# EAGLE design nixie_controller (EAGLE 9.5.2)

## Sheet 1 of 2
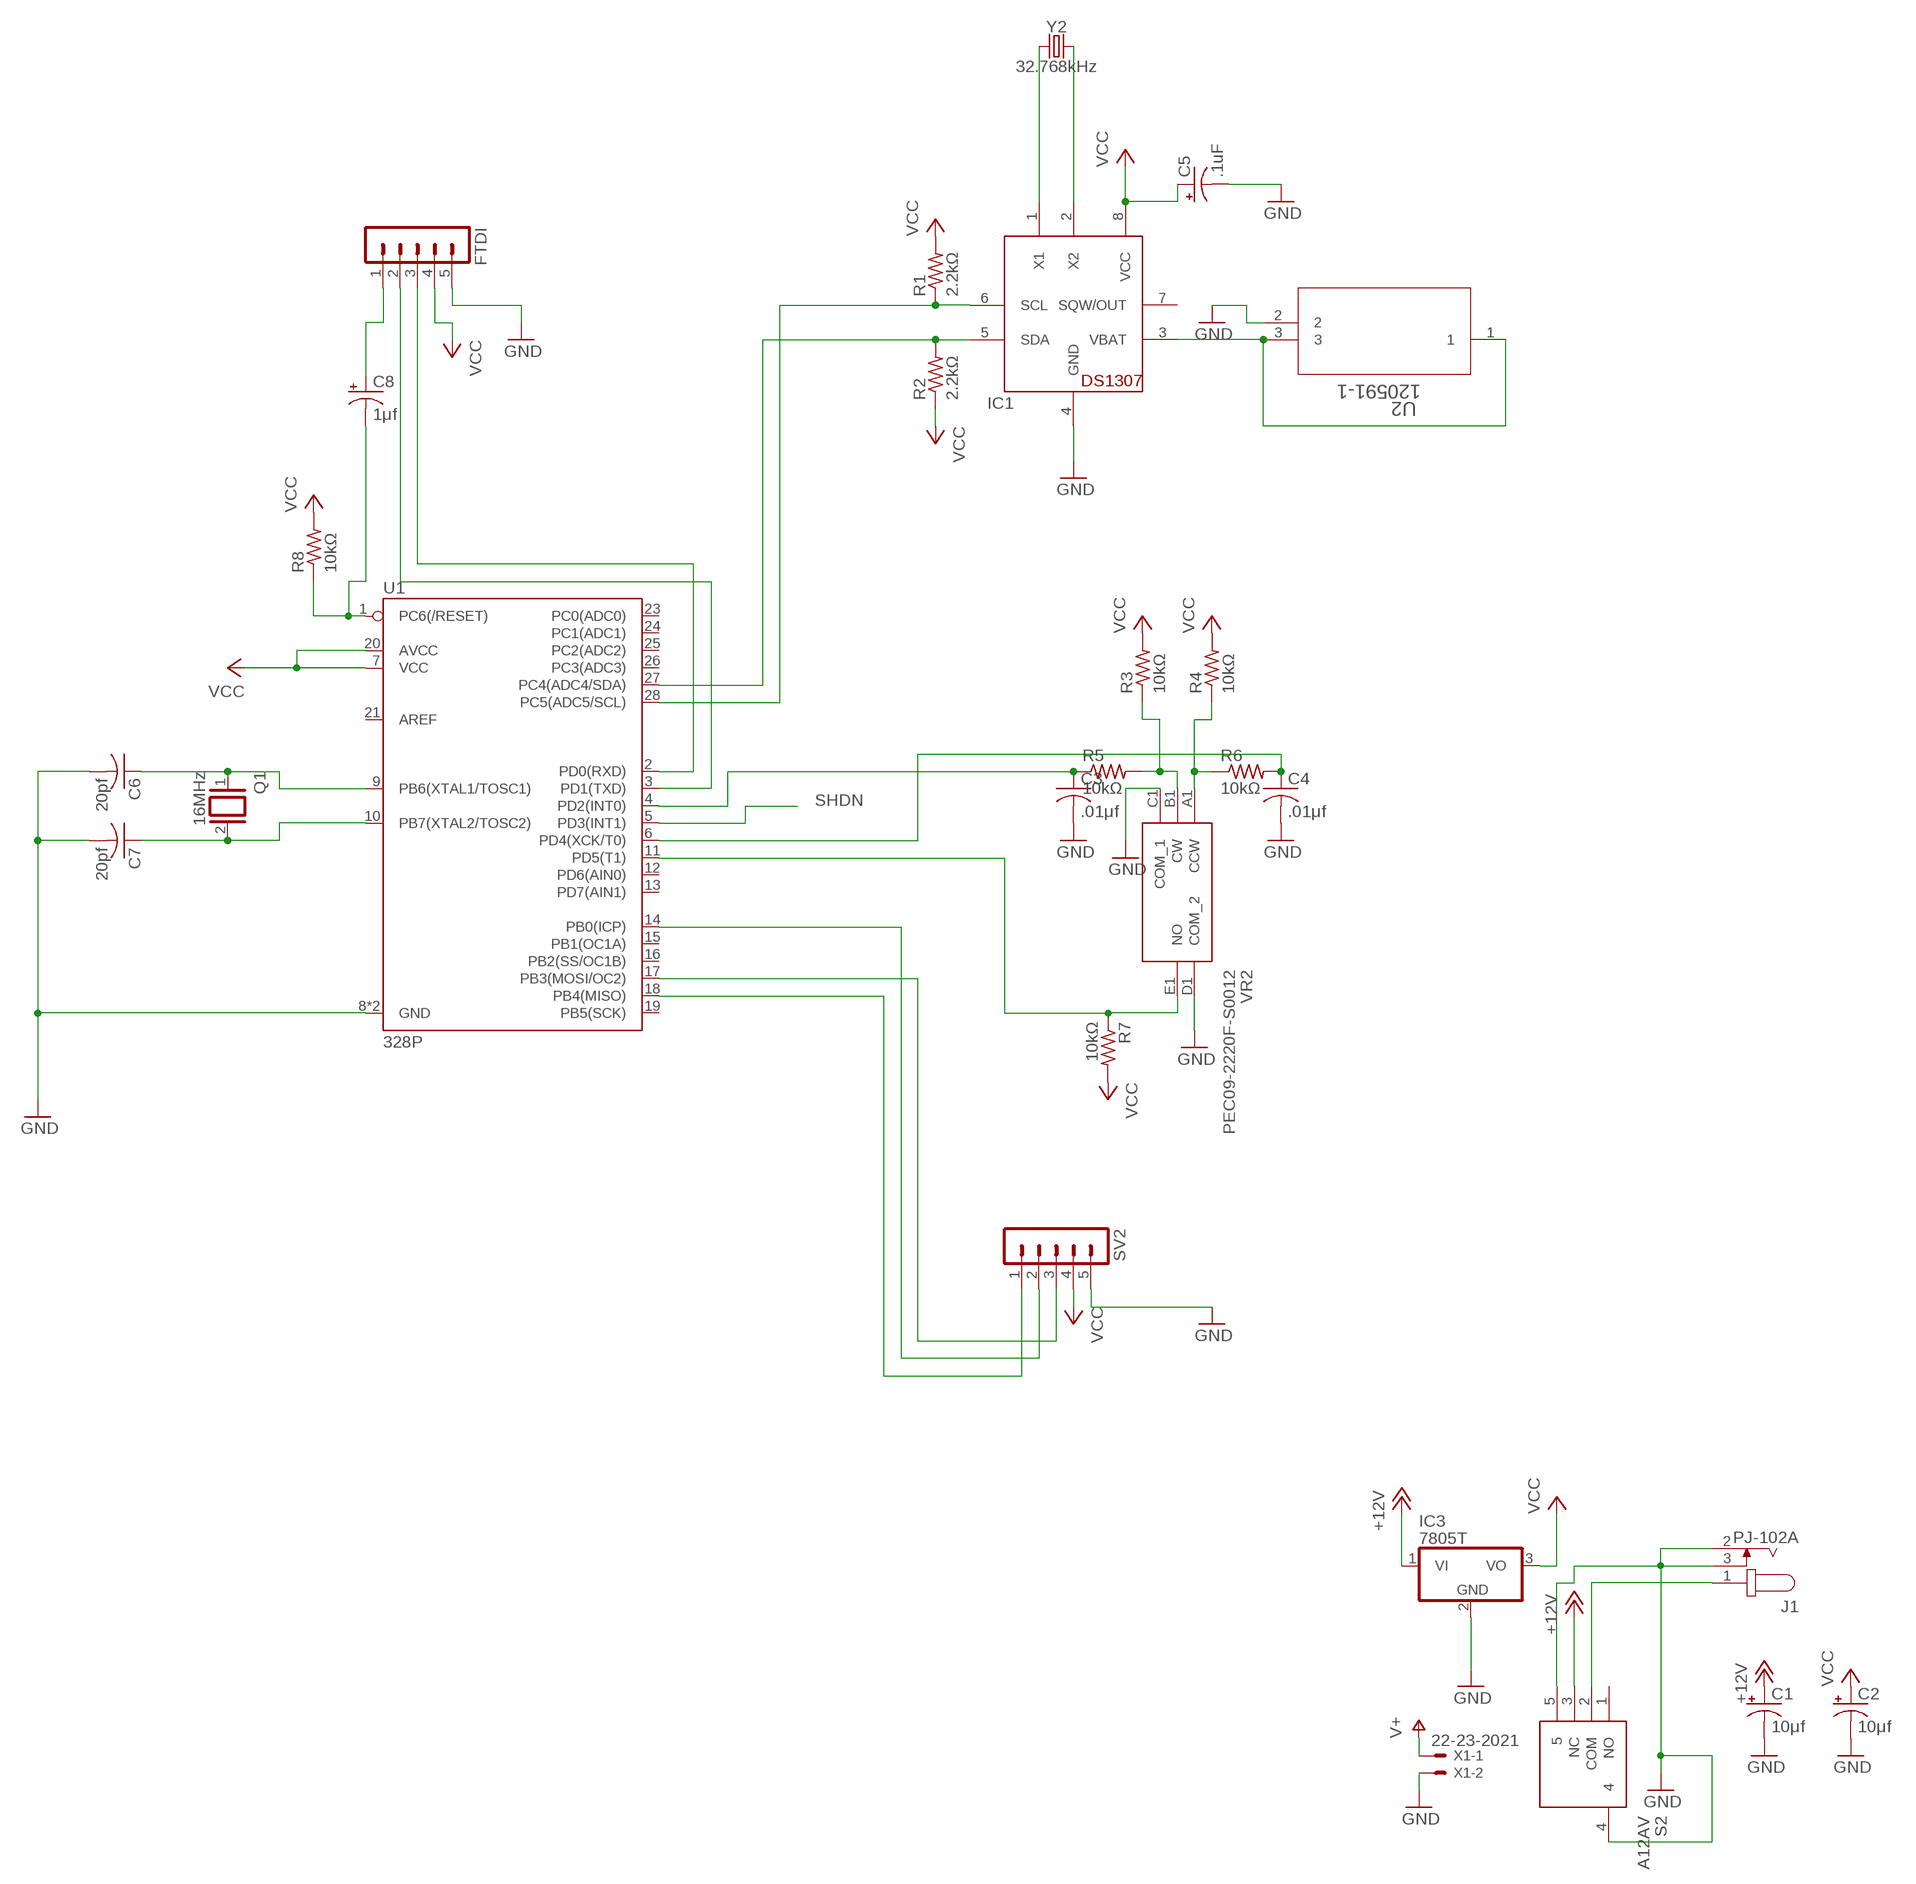
[diagram p0: schematic, sheet 1]

### Parts
C1  10μf  CPOL-USE2-5  [E2-5]
C2  10μf  CPOL-USE2-5  [E2-5]
C3  .01μf  C-US050-030X075  [C050-030X075]
C4  .01μf  C-US050-030X075  [C050-030X075]
C5  .1uF  CPOL-USE2-5  [E2-5]
C6  20pf  C-US050-030X075  [C050-030X075]
C7  20pf  C-US050-030X075  [C050-030X075]
C8  1μf  CPOL-USE2-5  [E2-5]
FTDI  MA05-1  [MA05-1]
IC1  DS1307  [DIL08]
IC3  7805T  [TO220H]
J1  PJ-102A  [CUI_PJ-102A]
Q1  16MHz  XTAL/S  [QS]
R1  2.2kΩ  R-US_0207/10  [0207/10]
R2  2.2kΩ  R-US_0207/10  [0207/10]
R3  10kΩ  R-US_0207/10  [0207/10]
R4  10kΩ  R-US_0207/10  [0207/10]
R5  10kΩ  R-US_0207/10  [0207/10]
R6  10kΩ  R-US_0207/10  [0207/10]
R7  10kΩ  R-US_0207/10  [0207/10]
R8  10kΩ  R-US_0207/10  [0207/10]
S2  A12AV  [A12AV]
SV2  MA05-1  [MA05-1]
U1  328P  ATMEGA328P_PDIP  [DIP28]
U2  120591-1  [CONN3_120591-1]
VR2  PEC09-2220F-S0012  [PEC092220FS0012]
X1  22-23-2021  [22-23-2021]
Y2  32.768kHz  CRYSTAL-32.768KHZPTH-2X6  [CRYSTAL-PTH-2X6-CYL]

### Nets
+12V: C1.+ IC3.1(VI) S2.3(NC) ; also sheet 2
CLK: SV2.1 U1.18(PB4(MISO))
GND [power]: C1.- C2.- C3.2 C4.2 C5.- C6.2 C7.2 FTDI.5 IC1.4(GND) IC3.2(GND) J1.2 J1.3 S2.4 S2.5 SV2.5 U1.8(GND) U1.22(GND) U2.2 VR2.C1(COM_1) VR2.D1(COM_2) X1.2 ; also sheet 2
N$1: IC1.3(VBAT) U2.1 U2.3
N$2: R7.1 U1.11(PD5(T1)) VR2.E1(NO)
N$3: R4.1 R6.1 VR2.A1(CCW)
N$4: IC1.1(X1) Y2.1
N$5: IC1.2(X2) Y2.2
N$6: J1.1 S2.2(COM)
N$7: SV2.2 U1.14(PB0(ICP))
N$9: C3.1 R5.1 U1.4(PD2(INT0))
N$10: C4.1 R6.2 U1.6(PD4(XCK/T0))
N$11: C6.1 Q1.1 U1.9(PB6(XTAL1/TOSC1))
N$12: IC1.6(SCL) R1.1 U1.28(PC5(ADC5/SCL))
N$13: IC1.5(SDA) R2.2 U1.27(PC4(ADC4/SDA))
N$14: C8.- R8.1 U1.1(PC6(/RESET))
N$15: R3.1 R5.2 VR2.B1(CW)
N$16: C7.1 Q1.2 U1.10(PB7(XTAL2/TOSC2))
N$17: C8.+ FTDI.1
N$18: SV2.3 U1.17(PB3(MOSI/OC2))
N$21: FTDI.2 U1.3(PD1(TXD))
N$22: FTDI.3 U1.2(PD0(RXD))
SHDN: U1.5(PD3(INT1)) ; also sheet 2
V+: X1.1 ; also sheet 2
VCC: C2.+ C5.+ FTDI.4 IC1.8(VCC) IC3.3(VO) R1.2 R2.1 R3.2 R4.2 R7.2 R8.2 SV2.4 U1.7(VCC) U1.20(AVCC)
Unconnected: IC1.7(SQW/OUT) S2.1(NO) U1.12(PD6(AIN0)) U1.13(PD7(AIN1)) U1.15(PB1(OC1A)) U1.16(PB2(SS/OC1B)) U1.19(PB5(SCK)) U1.21(AREF) U1.23(PC0(ADC0)) U1.24(PC1(ADC1)) U1.25(PC2(ADC2)) U1.26(PC3(ADC3))

## Sheet 2 of 2
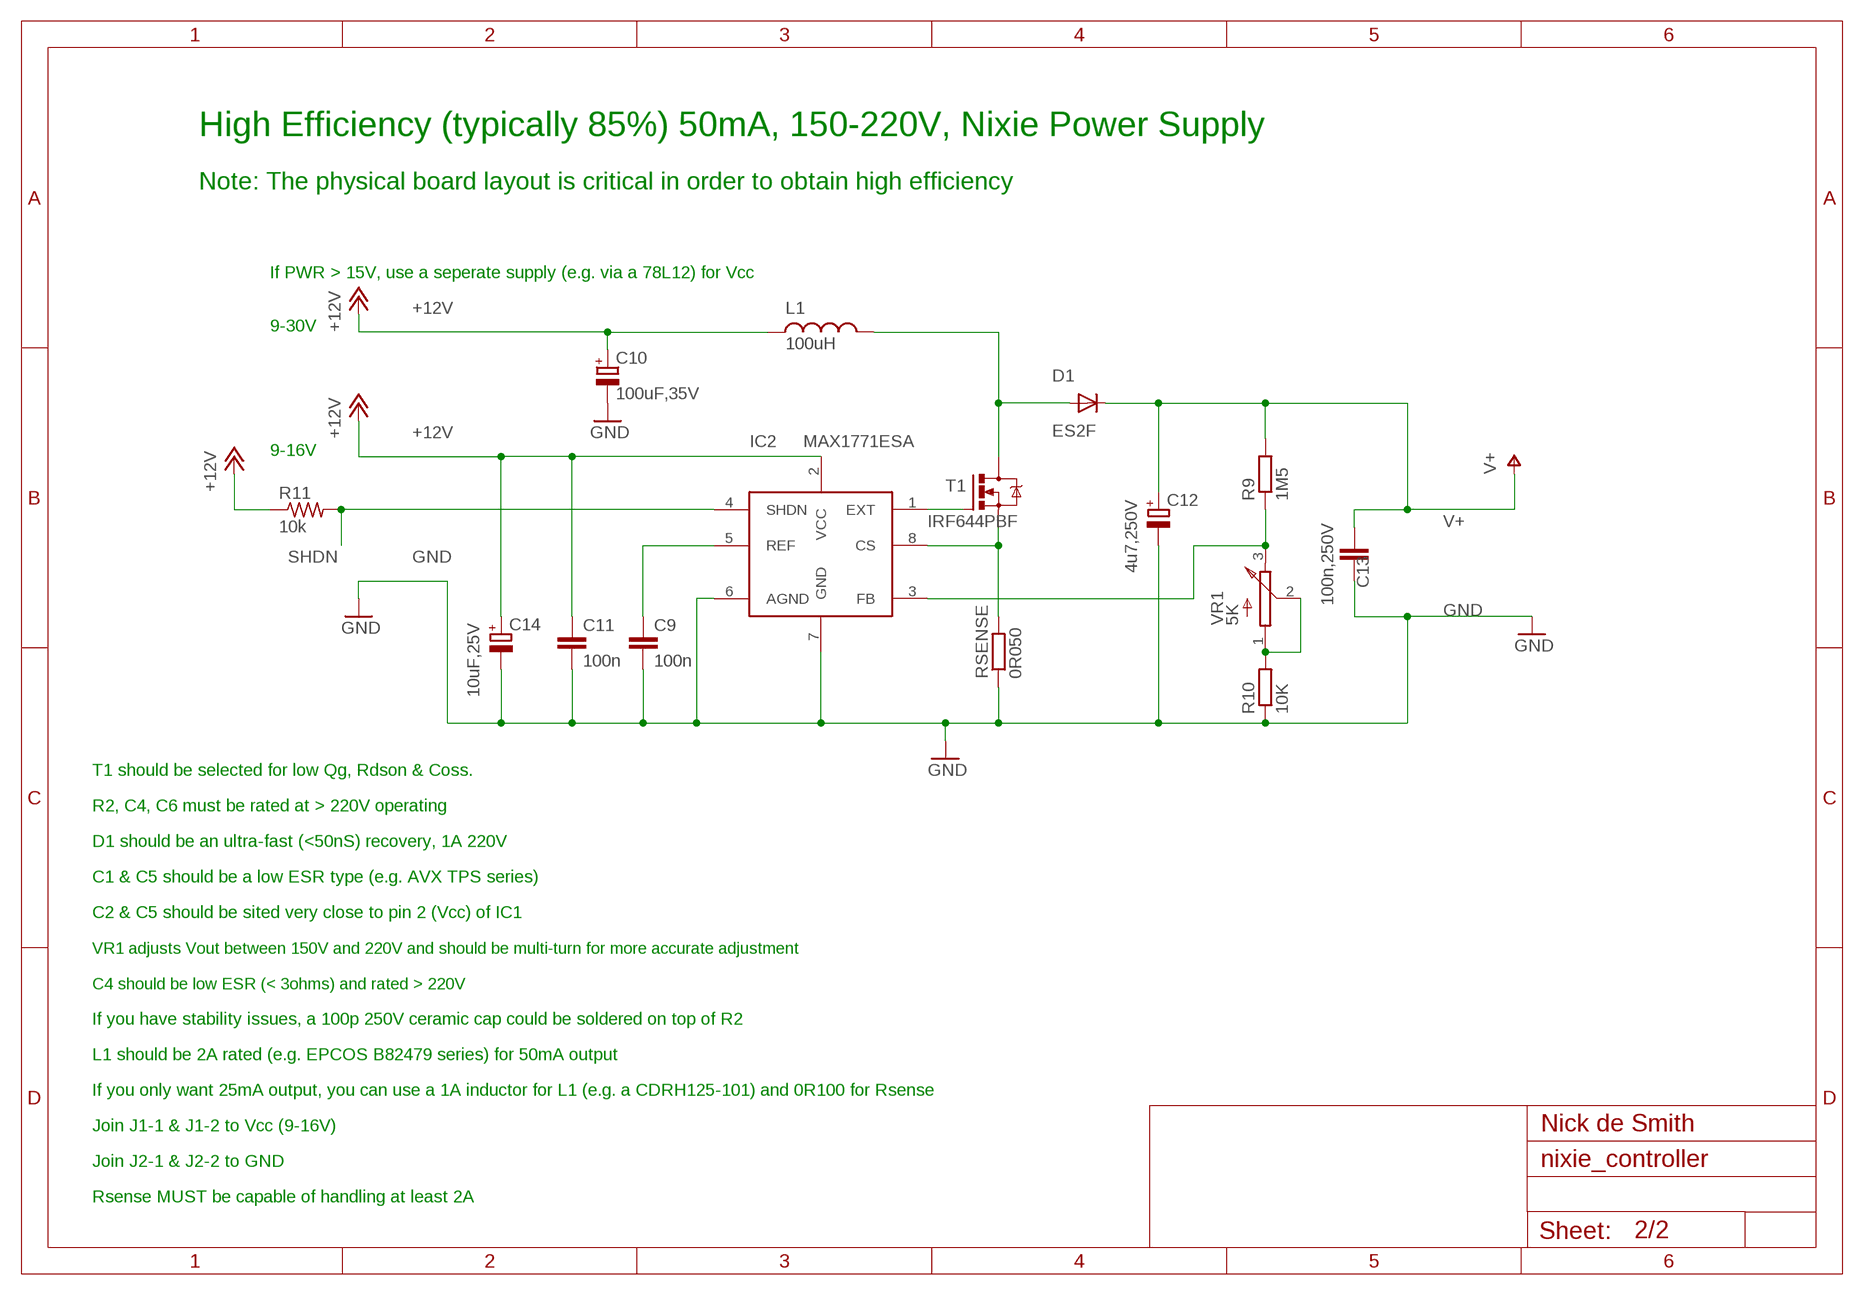
[diagram p1: schematic, sheet 2]

### Parts
C9  100n  C-EUC0805  [C0805]
C10  100uF,35V  C-POL-EU7343  [C-EIA-7343]
C11  100n  C-EUC0805  [C0805]
C12  4u7,250V  C-POL-EU-NICHICON-UJ-12  [NICHICON-UJ-12]
C13  100n,250V  C-EU-2420  [C2420]
C14  10uF,25V  C-POL-EU7343  [C-EIA-7343]
D1  ES2F  DIODE-SMC  [SMC]
IC2  MAX1771ESA  [SO-8]
L1  100uH  L-SMT-POWER-B82479  [L-B82479]
R9  1M5  R-EU_R2512  [R2512]
R10  10K  R-EU_R0805  [R0805]
R11  10k  R-US_M0805  [M0805]
RSENSE  0R050  R-EU_R2010  [R2010]
T1  IRF644PBF  IRF740  [TO220BV]
VR1  5K  TRIMPOT-3214W  [BOURNS-3214W]

### Nets
+12V: C10.+ C11.1 C14.+ IC2.2(VCC) L1.P$1 R11.1 ; also sheet 1
EXT: IC2.1(EXT) T1.G
GND [power]: C9.2 C10.- C11.2 C12.1(-) C13.P$2 C14.- IC2.6(AGND) IC2.7(GND) R10.1 RSENSE.1 ; also sheet 1
N$8: IC2.3(FB) R9.1 VR1.3(B)
N$19 [power]: D1.A L1.P$2 T1.D
N$20: C9.1 IC2.5(REF)
N$23: R10.2 VR1.1(A) VR1.2(W)
N$24: IC2.8(CS) RSENSE.2 T1.S
SHDN: IC2.4(SHDN) R11.2 ; also sheet 1
V+: C12.2(+) C13.P$1 D1.C R9.2 ; also sheet 1

### Notes on the sheet
- High Efficiency (typically 85%) 50mA, 150-220V, Nixie Power Supply
- Note: The physical board layout is critical in order to obtain high efficiency
- If PWR > 15V, use a seperate supply (e.g. via a 78L12) for Vcc
- 9-30V
- 9-16V
- T1 should be selected for low Qg, Rdson & Coss.
- R2, C4, C6 must be rated at > 220V operating
- D1 should be an ultra-fast (<50nS) recovery, 1A 220V
- C1 & C5 should be a low ESR type (e.g. AVX TPS series)
- C2 & C5 should be sited very close to pin 2 (Vcc) of IC1
- VR1 adjusts Vout between 150V and 220V and should be multi-turn for more accurate adjustment
- C4 should be low ESR (< 3ohms) and rated > 220V
- If you have stability issues, a 100p 250V ceramic cap could be soldered on top of R2
- L1 should be 2A rated (e.g. EPCOS B82479 series) for 50mA output
- If you only want 25mA output, you can use a 1A inductor for L1 (e.g. a CDRH125-101) and 0R100 for Rsense
- Join J1-1 & J1-2 to Vcc (9-16V) | Nick de Smith
- Join J2-1 & J2-2 to GND
- Rsense MUST be capable of handling at least 2A

## Library data of the parts
C1 C2 C5 C8 = rcl:CPOL-US: POLARIZED CAPACITOR, American symbol; SPICEPREFIX: C
C3 C4 C6 C7 = rcl:C-US: CAPACITOR, American symbol; SPICEPREFIX: C
C9 C11 = rcl:C-EU: CAPACITOR, European symbol
C10 C14 = nick:C-POL-EU7343: Capacitor, Tantalum, EU 7343 case, polarised
C12 = nick:C-POL-EU: Capacitor, Tantalum, EU 7343 case, polarised
C13 = nick:C-EU
D1 = diode:DIODE-: DIODE
FTDI SV2 = con-lstb:MA05-1: PIN HEADER; OC_FARNELL: unknown; OC_NEWARK: unknown
IC1 = adafruit:DS1307: DS1307 Real time clock (RTC) with battery backup ability. Talk to it via i2c
IC2 = nick:MAX1771
IC3 = linear:78*: Positive VOLTAGE REGULATOR Source: http://cache.national.com/ds/LM/LM78L05.pdf http://www.fairchildsemi.com/ds/LM/LM7805.pdf
J1 = PJ-102A:PJ-102A: 2.0 mm Center Pin, 2.5 A, Right Angle, Through Hole, Tapered Pins, Dc Power Jack Connector; MANUFACTURER: CUI INC; PART_REV: 1.03; STANDARD: Manufacturer recommendations
L1 = nick:L-SMT-POWER: SMT power inductors
Q1 = special:XTAL/S: CRYSTAL
R1-R8 R11 = rcl:R-US_: RESISTOR, American symbol; SPICEPREFIX: R
R9 R10 RSENSE = rcl:R-EU_: RESISTOR, European symbol
S2 = SamacSys_Parts:A12AV: Toggle Switch SPDT On-None-On, 100 mA, PCB Source: Datasheet <https://componentsearchengine.com/Datasheets/1/A12AV.pdf>; DESCRIPTION: Toggle Switch SPDT On-None-On, 100 mA, PCB; HEIGHT: 10mm; MANUFACTURER_NAME: NKK Switches; MANUFACTURER_PART_NUMBER: A12AV; MOUSER_PART_NUMBER: 633-A12AV; MOUSER_PRICE-STOCK: https://www.mouser.com/Search/Refine.aspx?Keyword=633-A12AV
T1 = transistor-power:IRF740: N-CHANNEL MOS FET
U1 = SparkFun-IC-Microcontroller:ATMEGA328P_PDIP: Atmel 328P Through hole ATMEGA328P uC used in the Arduino 32kb flash, 1k EEPROM, 2k SRAM Datasheet <http://www.sparkfun.com/datasheets/Components/SMD/ATMega328.pdf> SparkFun Products Storefront component: AVR 28 Pin 20MHz 32K 6A/D - ATMega328P <https://www.sparkfun.com/products/9061> (COM-09061) SparkFun Simon Says - Through-Hole Soldering Kit <https://www.sparkfun.com/products/10547> (KIT-10547) SparkFun Learn to Solder - Simon Says <https://www.sparkfun.com/products/13708> (KIT-13708) SparkFun BigTime Watch Kit <https://www.sparkfun.com/products/11734> (KIT-11734) SparkFun ClockIt <https://www.sparkfun.com/products/10930> (KIT-10930) SparkFun Serial Enabled LCD Kit <https://www.sparkfun.com/products/10097> (LCD-10097) SparkFun Simon Tilts - Through Hole Soldering Kit <https://www.sparkfun.com/products/12634> (KIT-12634) SparkFun Frequency Counter Kit <https://www.sparkfun.com/products/10140> (KIT-10140) FabFM Radio Kit <https://www.sparkfun.com/products/11043> (KIT-11043) SparkFun Binary Blaster Kit <https://www.sparkfun.com/products/12037> (KIT-12037) SparkFun Metro-Gnome <https://www.sparkfun.com/products/9236> (KIT-09236) ATmega328 with Arduino Optiboot (Uno) <https://www.sparkfun.com/products/10524> (DEV-10524); PROD_ID: IC-09136
U2 = TE Connectivity AMP Connectors 120591-1:120591-1; BUILT_BY: EMA_UL_Team; COPYRIGHT: Copyright (C) 2016 Accelerated Designs. All rights reserved; DESCRIPTION: TOP LOAD BATTERY; MANUFACTURER_PART_NUMBER: 120591-1; PITCH_MM_: -; POSITIONS: 2; PRODUCT: Battery Holders; ROWS-CONFIG: -; TE_PART_NUMBER: 120591-1; TYPE: Coin Cell; VENDOR: TE Connectivity
VR1 = nick:TRIMPOT
VR2 = SamacSys_Parts:PEC09-2220F-S0012: Encoders 12PPR 24Detents 5V 2bit GrayCodeFlatted Source: Datasheet <https://componentsearchengine.com/Datasheets/1/PEC09-2220F-S0012.pdf>; DESCRIPTION: Encoders 12PPR 24Detents 5V 2bit GrayCodeFlatted; HEIGHT: 11.35mm; MANUFACTURER_NAME: Bourns; MANUFACTURER_PART_NUMBER: PEC09-2220F-S0012; MOUSER_PART_NUMBER: 652-PEC092220FS0012; MOUSER_PRICE-STOCK: https://www.mouser.com/Search/Refine.aspx?Keyword=652-PEC092220FS0012
X1 = con-molex:22-23-2021: .100" (2.54mm) Center Header - 2 Pin; MF: MOLEX; MPN: 22-23-2021; OC_FARNELL: 1462926; OC_NEWARK: 25C3832
Y2 = SparkFun-Clocks:CRYSTAL-32.768KHZ: 32.768kHz Crystal Frequency: 32.768kHz Frequency Stability: ±20ppm Load Capacitance: 12.5pF (PTH-2X6 & SMD-3.2X1.5), 6pF (SMD-2X6) SparkFun Products: SparkFun BigTime Watch Kit <https://www.sparkfun.com/products/11734> SparkFun nRF52832 Breakout <https://www.sparkfun.com/products/13990> SparkFun Real Time Clock Module <https://www.sparkfun.com/products/12708>; PROD_ID: XTAL-10112

## Net classes
1 power: width 0.762 mm, clearance 0.508 mm

## Board
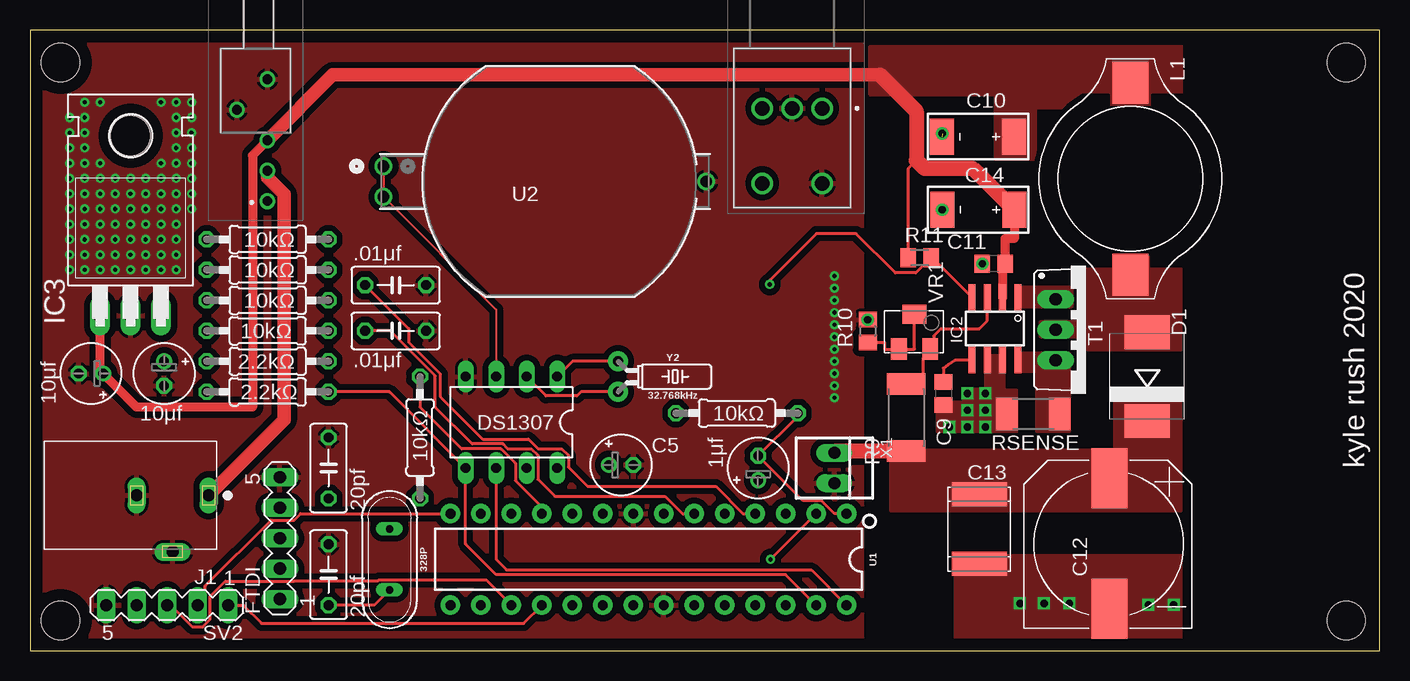
[diagram p2: board, top side]
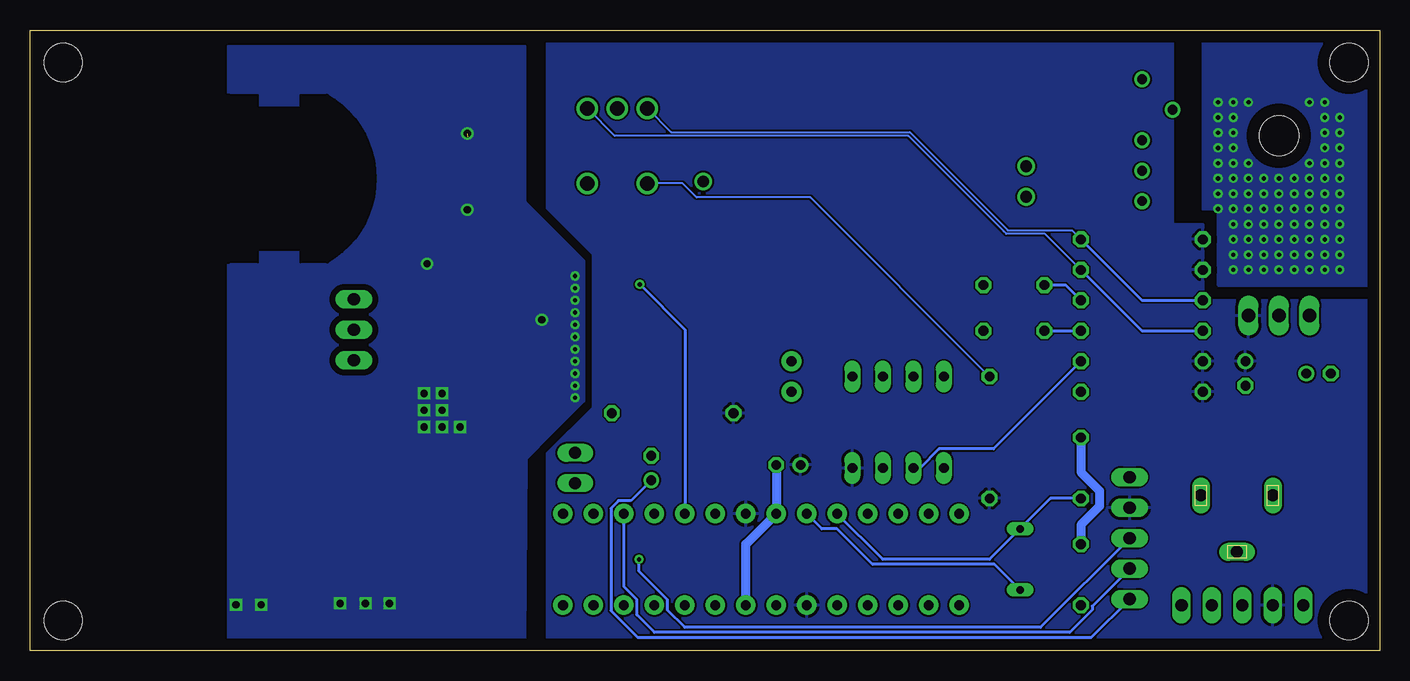
[diagram p3: board, bottom side, seen from below]

Size 112.5 x 51.74 mm. Coordinates in mm from the lower left corner, seen from the top.
Outline: 0,0 112.5,0 112.5,51.74 0,51.74 0,0
Copper layers (1*16): Top 0.035mm / dielectric 1.5mm / Bottom 0.035mm
Design rules "default": minimum track width 6mil, minimum drill 0.35mm, track to track 6mil, track to pad 6mil, pad to pad 6mil, via to via 6mil, smd to smd 6mil, copper to edge 40mil, drill to drill 6mil, minimum pad ring 10mil, minimum via ring 8mil, stop-mask expansion 4mil, vias tented up to drill 0mil, thermal gap 10mil
Holes 3.17 mm at 2.54,49.02 2.54,2.54 109.73,49.02 109.73,2.54

### Footprints (pad centres in the part's own frame; a part is rotated, then mirrored left to right if it is on the bottom)
E2-5 = drill 0.813 pad 1.27: + -1.016,0 | drill 0.813 pad 1.27 octagon: - 1.016,0
C050-030X075 = drill 0.813 octagon: 1 -2.54,0; 2 2.54,0
C0805 = smd 1.3 x 1.5: 1 -0.95,0; 2 0.95,0
C-EIA-7343 = smd 2 x 3: + -3,0; - 3,0
NICHICON-UJ-12 = smd 3 x 5: 1 -2.4,-7.6; 2 -2.4,3.3
C2420 = smd 2 x 4.6: P$1 2.9,0; P$2 -2.9,0
SMC = smd 2.8 x 3.8: A 3.7,0; C -3.7,0
MA05-1 = drill 1.016 long: 1 -5.08,0; 2 -2.54,0; 3 0,0; 4 2.54,0; 5 5.08,0
DIL08 = drill 0.813 long: 1 -3.81,-3.81; 2 -1.27,-3.81; 3 1.27,-3.81; 4 3.81,-3.81; 5 3.81,3.81; 6 1.27,3.81; 7 -1.27,3.81; 8 -3.81,3.81
SO-8 = smd 0.6 x 2.2: 1 -1.905,-2.6; 2 -0.635,-2.6; 3 0.635,-2.6; 4 1.905,-2.6; 5 1.905,2.6; 6 0.635,2.6; 7 -0.635,2.6; 8 -1.905,2.6
TO220H = drill 1.118 long: 1 -2.54,-10.16; 2 0,-10.16; 3 2.54,-10.16 | hole 3.302: 0,4.826
CUI_PJ-102A = drill 1 long: 1 -6.5,0; 2 -0.5,0; 3 -3.5,4.7
L-B82479 = smd 3.5 x 3: P$1 -8,0; P$2 8,0
QS = drill 0.61 long: 1 -2.54,0; 2 2.54,0
0207/10 = drill 0.813 octagon: 1 -5.08,0; 2 5.08,0
R2512 = smd 1.8 x 3.2: 1 -2.8,0; 2 2.8,0
R0805 = smd 1.3 x 1.5: 1 -0.95,0; 2 0.95,0
M0805 = smd 1.3 x 1.6: 1 -0.95,0; 2 0.95,0
R2010 = smd 1.8 x 2.7: 1 -2.2,0; 2 2.2,0
A12AV = drill 0.8 pad 1.3: 1 -1,8.5; 2 -1,5.96; 3 -1,3.42; 4 1.54,0.88; 5 -1,-1.66
TO220BV = drill 1.016 long: D 0,-2.54; G -2.54,-2.54; S 2.54,-2.54
DIP28 = drill 0.813 pad 1.626: 1 -16.51,-3.81; 2 -13.97,-3.81; 3 -11.43,-3.81; 4 -8.89,-3.81; 5 -6.35,-3.81; 6 -3.81,-3.81; 7 -1.27,-3.81; 8 1.27,-3.81; 9 3.81,-3.81; 10 6.35,-3.81; 11 8.89,-3.81; 12 11.43,-3.81; 13 13.97,-3.81; 14 16.51,-3.81; 15 16.51,3.81; 16 13.97,3.81; 17 11.43,3.81; 18 8.89,3.81; 19 6.35,3.81; 20 3.81,3.81; 21 1.27,3.81; 22 -1.27,3.81; 23 -3.81,3.81; 24 -6.35,3.81; 25 -8.89,3.81; 26 -11.43,3.81; 27 -13.97,3.81; 28 -16.51,3.81
CONN3_120591-1 = drill 0.965 pad 1.473: 1 -13.462,1.27; 2 13.462,0; 3 -13.462,-1.27
BOURNS-3214W = smd 1.8 x 1.3: 1 1.4,-1.3; 3 1.4,1.3 | smd 1.6 x 2: 2 -1.5,0
PEC092220FS0012 = drill 1.2 pad 1.8: A1 0,0; B1 0,5; C1 0,2.5; D1 -6.25,0; E1 -6.25,5
22-23-2021 = drill 1 long: 1 -1.27,0; 2 1.27,0
CRYSTAL-PTH-2X6-CYL = drill 0.813 pad 1.676: 1 -1.27,0; 2 1.27,0

### Placement (x,y rotation side)
C1  5.08,23.11 180 top
C2  11.18,23.11 270 top
C3  30.48,30.48 0 top
C4  30.48,26.67 0 top
C5  49.28,15.49 0 top
C6  24.89,6.35 90 top
C7  24.89,15.24 90 top
C8  60.71,15.24 90 top
C9  76.14,21.45 270 top
C10  79.04,42.85 180 top
C11  80.34,32.25 180 top
C12  92.37,11.09 0 top
C13  79.14,10.15 90 top
C14  79.05,36.76 180 top
D1  93.14,22.85 90 top
FTDI  20.83,9.4 90 top
IC1  40.13,19.05 180 top
IC2  80.44,26.85 180 top
IC3  8.38,38.1 0 top
J1  8.38,12.95 180 top
L1  91.74,39.35 270 top
Q1  29.97,7.62 90 top
R1  19.81,24.13 180 top
R2  19.81,21.59 0 top
R3  19.81,34.29 180 top
R4  19.81,31.75 180 top
R5  19.81,29.21 180 top
R6  19.81,26.67 0 top
R7  32.51,17.78 270 top
R8  58.93,19.81 180 top
R9  73.04,19.45 270 top
R10  69.84,26.65 270 top
R11  74.17,32.77 0 top
RSENSE  83.64,19.75 0 top
S2  18.8,45.97 180 top
SV2  11.43,3.81 180 top
T1  88.04,26.75 270 top
U1  51.56,7.62 180 top
U2  42.93,39.12 0 top
VR1  73.74,26.55 270 top
VR2  66.04,45.21 90 top
X1  67.06,15.24 270 top
Y2  49.02,22.86 270 top

### Tracks (layer width: path | path; a pad name or v marks a point on that pad's centre or on a via)
+12V
  Top 0.254: R11.1 73.22,40.2 73.89,40.88
  Top 0.762: C14.+ 82.05,34.35 81.29,34.35 C11.1 81.07,32.25 IC2.2 | S2.3 18.54,41.3 18.54,20.32 8.89,20.32 C1.+ 5.84,23.37 IC3.1
  Top 1.143: S2.3 25.25,48.01 70.87,48.01
  Top 1.27: 70.87,48.01 73.89,44.98 73.89,40.88 74.56,40.21 78.6,40.21 C14.+
  pour Top (isolate 0.01, rank 2, no thermals): 80.44,46.35 80.44,40.95 83.84,40.95 83.84,45.25 96.04,45.25 96.04,50.35 69.98,50.35 69.98,46.35
CLK
  Top 0.254: SV2.1 17.78,3.81 19.3,2.29 41.15,2.29 U1.18
EXT
  pour Top (no thermals): 86.84,30.35 86.84,28.65 82.24,28.65 82.24,30.35
GND  (via drill 0.35, 0.35 pad 0.6, 0.6, 0.6 pad 1.02)  (1 unrouted)
  Bottom 0.762: U1.22 52.83,8.89 U1.8 C5.- | C7.2 24.89,14.89 23.34,13.34 23.34,12.06 24.89,10.51 C6.2
  other vias: 69.84,27.6 76.05,36.76 79.39,32.25 79.64,21.45 78.14,20.05 76.64,18.65 78.14,18.65 79.64,18.65 79.64,20.05 78.14,21.45 86.64,3.95 84.54,3.95 82.54,3.95 93.24,3.85 95.34,3.85 10.92,45.72 12.19,45.72 13.46,45.72 13.46,44.45 12.19,43.18 12.19,44.45 5.84,45.72 4.57,45.72 4.57,44.45 3.3,44.45 3.3,43.18 4.57,43.18 4.57,41.91 3.3,41.91 3.3,40.64 4.57,40.64 5.84,40.64 5.84,39.37 4.57,39.37 3.3,39.37 3.3,38.1 4.57,38.1 5.84,38.1 7.11,38.1 7.11,39.37 8.38,39.37 8.38,38.1 9.65,38.1 9.65,39.37 10.92,39.37 10.92,40.64 12.19,40.64 12.19,41.91 13.46,41.91 13.46,43.18 13.46,40.64 13.46,39.37 12.19,39.37 12.19,38.1 13.46,38.1 13.46,36.83 12.19,36.83 10.92,36.83 10.92,38.1 9.65,36.83 9.65,35.56 10.92,35.56 12.19,35.56 12.19,34.29 10.92,34.29 9.65,34.29 9.65,33.02 10.92,33.02 12.19,33.02 12.19,31.75 10.92,31.75 9.65,31.75 8.38,31.75 8.38,33.02 8.38,34.29 8.38,35.56 8.38,36.83 7.11,36.83 7.11,35.56 5.84,35.56 5.84,36.83 4.57,36.83 3.3,36.83 3.3,35.56 4.57,35.56 4.57,34.29 3.3,34.29 3.3,33.02 4.57,33.02 5.84,33.02 5.84,34.29 7.11,34.29 7.11,33.02 7.11,31.75 5.84,31.75 4.57,31.75 3.3,31.75 76.05,43.11 67.06,31.24 67.06,30.23 67.06,29.21 67.06,28.19 67.06,27.18 67.06,26.16 67.06,25.15 67.06,24.13 67.06,23.11 67.06,21.08 67.06,22.1
  pour Top: 0,52.07 0,0 69.34,0 69.34,52.07
  pour Bottom (isolate 0.01, rank 3, no thermals): 96,50.35 96,0.75 71.21,0.75 71.12,16 66.29,20.83 66.29,32.51 71.21,37.43 71.21,50.35
  pour Top (no thermals): 79.68,24.62 81.19,24.62 81.19,21.75 82.24,21.75 82.24,18.25 75.64,18.25 75.64,20.75 77.84,20.75 77.84,21.85 79.68,21.85
  pour Top (rank 2, no thermals): 95.94,7.95 95.94,0.75 77.14,0.85 77.14,7.95
  pour Bottom: 14.73,52.07 14.73,36.83 13.46,36.83 13.46,30.48 -0.51,30.48 -0.51,52.07
N$1
  Top 0.152: U2.1 U2.3 38.86,28.45 IC1.3
N$2
  Top 0.254: U1.11 42.67,11.98 40.46,14.19 40.46,15.63 39.25,16.84 35.99,16.84 32.51,20.32 R7.1
  Bottom 0.152: VR2.E1 58.1,38.96 56.94,37.8 47.45,37.8 R7.1
N$3
  Bottom 0.152: R4.1 27.89,34.75 31.11,34.75 31.33,34.96 39.29,42.93 63.75,42.93 VR2.A1
  Bottom 0.254: R4.1 19.81,26.67 R6.1
N$4
  Top 0.254: Y2.1 45.21,24.13 IC1.1
N$5
  Top 0.254: Y2.2 45.93,21.59 45.6,21.26 43,21.26 IC1.2
N$6
  Top 1.143: S2.2 19.8,39.42 21.17,38.05 21.17,19.25 J1.1
N$7
  Top 0.254: SV2.2 14.61,4.45 14.61,5.41 20.09,10.9 22.02,10.9 22.55,11.43 U1.14
N$8
  Top 0.254: IC2.3 79.8,27.52 79.14,26.85 75.94,26.85 75.34,26.25 75.34,25.15 VR1.3 74.44,24.35 74.44,23.05 R9.1
N$9
  Top 0.254: C3.1 31.57,26.85 31.57,25.7 34.19,23.09 34.19,21.18 37.72,17.65 41.55,17.65 42.37,16.84 44.33,16.84 44.88,16.29 44.88,15.32 46.48,13.72 57.17,13.72 59.46,11.43 U1.4
  Bottom 0.254: R5.1 26.16,30.48 C3.1
N$10
  Top 0.254: U1.6 54.38,11.43 52.93,12.88 43.76,12.88 42.34,14.3 42.34,16.29 41.79,16.84 39.83,16.84 39.42,17.25 36.85,17.25 33.78,20.32 33.78,22.92 30.03,26.67 C4.1
  Bottom 0.254: C4.1 R6.2
N$11
  Top 0.254: Q1.1 28.7,3.81 C6.1
  Bottom 0.254: Q1.1 32.11,7.21 42.27,7.21 45.21,10.16 46.48,10.16 U1.9
N$12
  Top 0.254: IC1.6 38.86,7.62 39.73,6.76 65.13,6.76 U1.28
  Bottom 0.254: IC1.6 38.31,15.24 36.71,16.84 32.18,16.84 R1.1
N$13
  Top 0.254: R2.2 29.97,21.59 IC1.5 36.32,8.89 38.86,6.35 62.99,6.35 U1.27
N$14
  Top 0.254: R8.1 64.01,19.56 C8.- 64.44,12.52 65.98,12.52 67.08,11.43 U1.1
N$15
  Bottom 0.152: R3.1 25.65,35.05 30.99,35.05 39.17,43.23 59.06,43.23 VR2.B1
  Bottom 0.254: R3.1 19.81,29.21 R5.2
N$16
  Bottom 0.254: C7.1 27.43,12.7 Q1.2 32.51,7.62 41.4,7.62 U1.10
N$17
  Bottom 0.254: C8.+ 62.41,12.52 63.44,12.52 64.08,11.88 64.08,3.36 61.87,1.14 24,1.14 FTDI.1
N$18
  Top 0.254: SV2.3 11.73,3.81 13.54,2.01 14.4,2.01 15.01,2.62 15.01,4.55 16.28,5.82 22.02,5.82 22.05,5.84 28.99,5.84 29.07,5.92 38.02,5.92 U1.17
N$19
  pour Top (rank 2, no thermals): 93.24,31.85 95.94,31.85 95.94,25.05 88.14,25.05 88.14,26.15 84.24,26.15 84.24,27.45 88.14,27.45 88.14,31.85 90.64,31.85 90.64,32.85 93.24,32.85
N$20
  Top 0.254: C9.1 76.14,23.55 76.54,23.85 77.13,24.25 IC2.5
N$21
  Bottom 0.254: U1.3 62.99,5.36 61.9,4.26 61.9,3 60.45,1.55 25.82,1.55 23.95,3.42 23.95,3.73 FTDI.2
N$22  (via drill 0.35)
  Top 0.254: v61.72,7.62 U1.2
  Bottom 0.254: v61.72,7.62 61.72,6.62 59.36,4.26 59.36,3.4 57.91,1.96 28.27,1.96 FTDI.3
N$23
  Top 0.254: VR1.2 73.74,25.15 VR1.1 71.24,25.15 71.24,25.7 R10.2
N$24
  pour Top (no thermals): 82.44,24.83 86.64,24.83 86.64,18.25 83.94,18.25 83.94,23.25 82.44,23.25
SHDN  (via drill 0.35)
  Top 0.254: IC2.4 75.22,32.77 R11.2 73.85,31.5 72.14,31.5 68.86,34.78 65.55,34.78 61.67,30.89 v61.67,30.54
  Bottom 0.254: v61.67,30.54 57.91,26.78 U1.5
V+
  Top 1.27: X1.1 67.2,16.65 R9.2
  pour Top (isolate 0.01, rank 2, no thermals): 95.94,20.75 95.94,11.65 71.76,11.65 71.76,16.75 90.44,16.75 90.44,20.75
VCC
  pour Bottom: 17.27,52.07 17.27,35.56 14.73,35.56 14.73,29.21 0,29.21 0,0 69.34,0 69.34,16.51 65.53,20.32 65.53,33.02 69.34,36.83 69.34,52.07

### Text on the board
tPlace: kyle rush 2020
Measures: 0.000 | 0.146 | 1.839 | 1.655 | 1.512 | 1.508 | 0.154 | 0.000 | 0.000 | 0.001 | 0.000 | 0.001 | 0.000 | 0.000 | 1.209 | 2.026